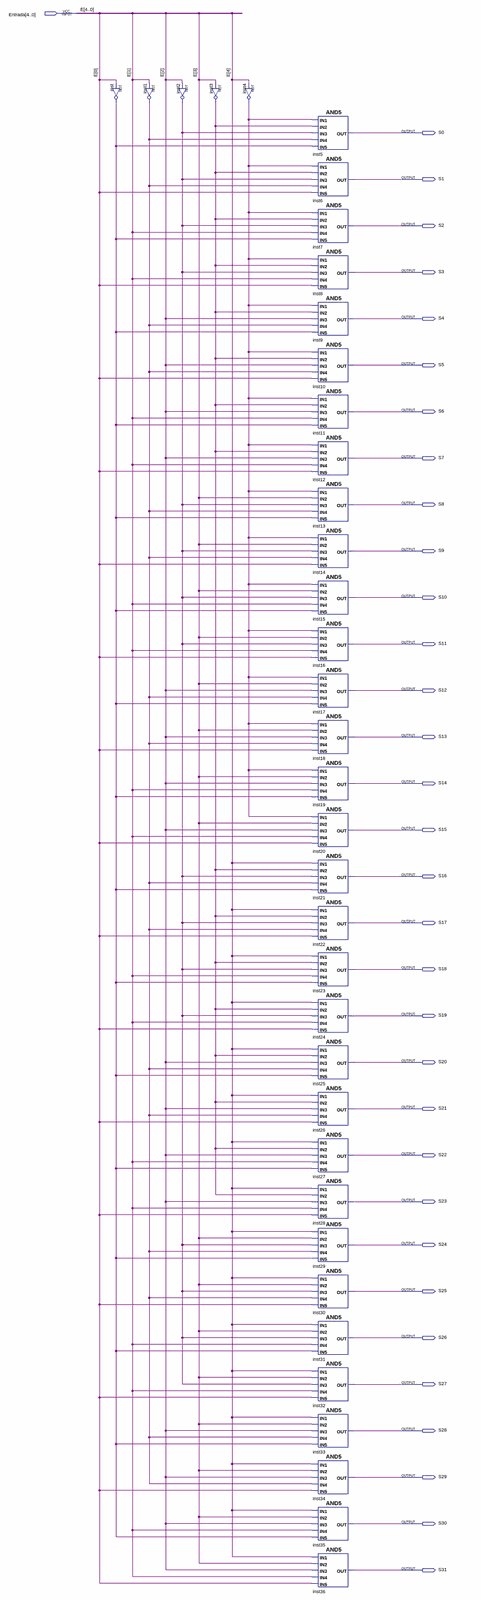
[diagram p0: schematic sheet, whole]
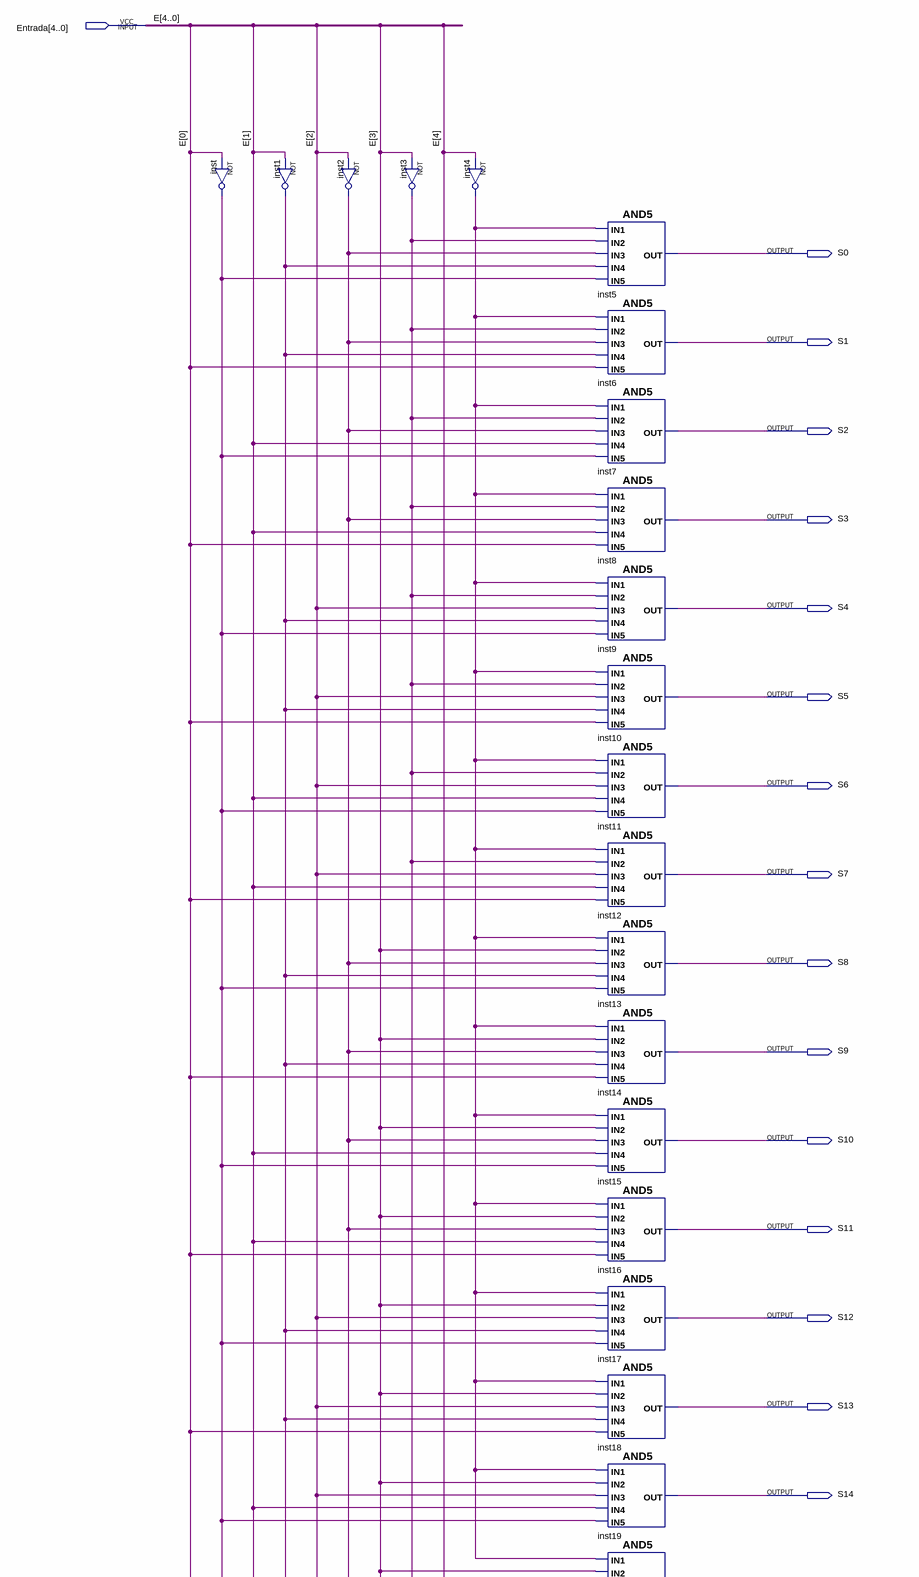
[diagram p1: schematic sheet, upper part]
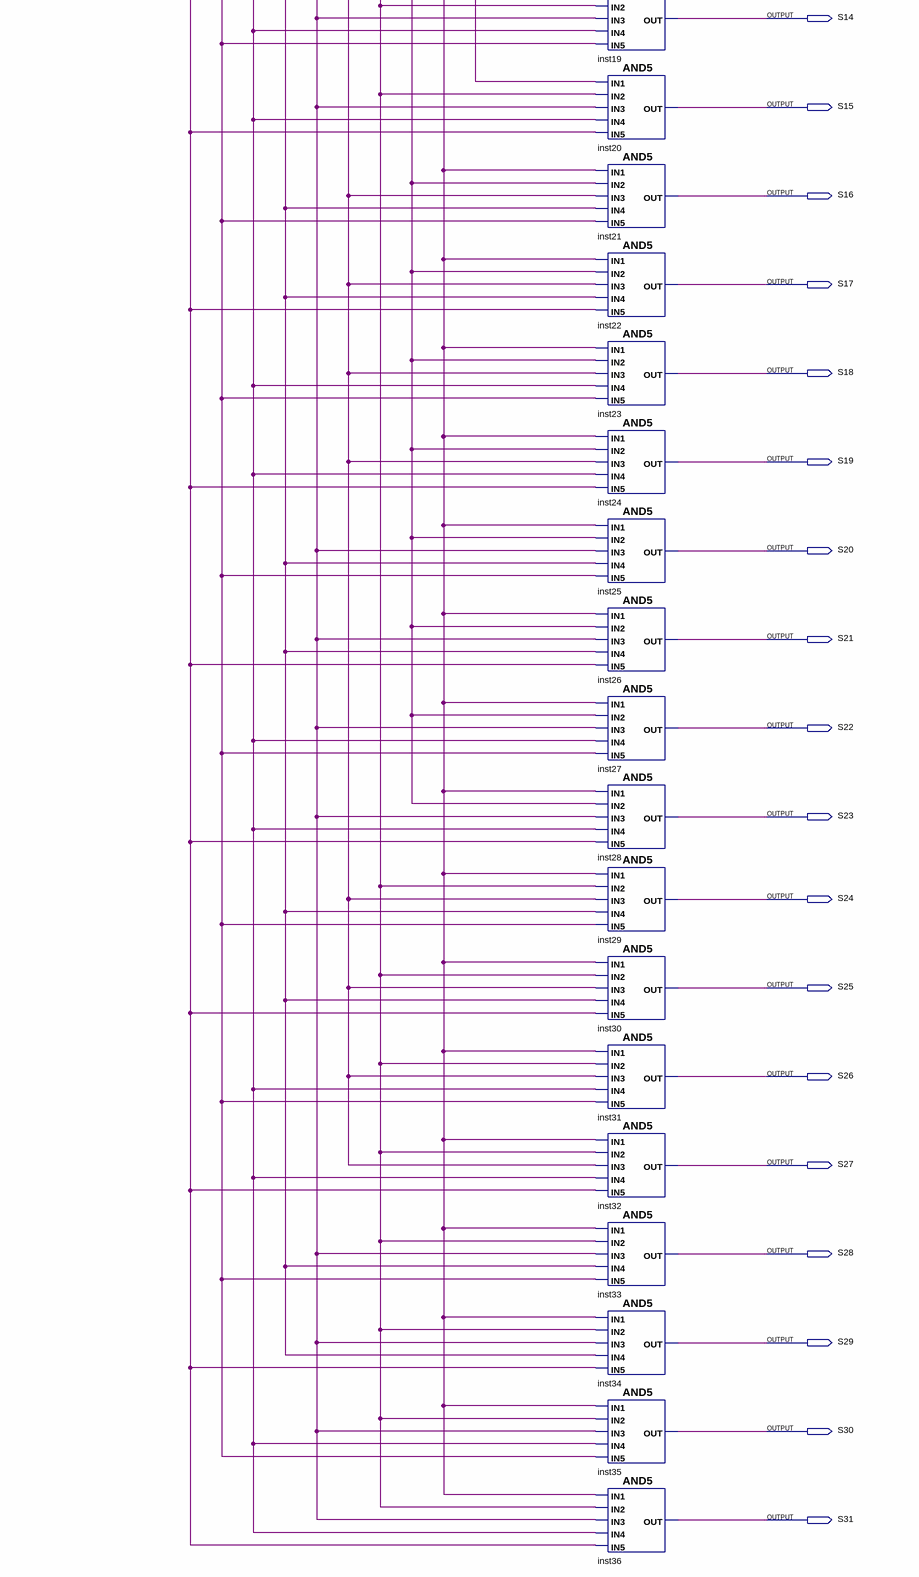
[diagram p2: schematic sheet, lower part]
// Quartus schematic Demu5x32.bdf as structural Verilog: 37 symbols, 33 pins
module Demu5x32 (
  input  [4:0] Entrada,
  output S0,
  output S1,
  output S2,
  output S3,
  output S4,
  output S5,
  output S6,
  output S7,
  output S8,
  output S9,
  output S10,
  output S11,
  output S12,
  output S13,
  output S14,
  output S15,
  output S16,
  output S17,
  output S18,
  output S19,
  output S20,
  output S21,
  output S22,
  output S23,
  output S24,
  output S25,
  output S26,
  output S27,
  output S28,
  output S29,
  output S30,
  output S31
);

  wire inst1_out, inst2_out, inst3_out, inst4_out, inst_out;

  not inst (inst_out, Entrada[0]);
  not inst1 (inst1_out, Entrada[1]);
  not inst2 (inst2_out, Entrada[2]);
  not inst3 (inst3_out, Entrada[3]);
  not inst4 (inst4_out, Entrada[4]);
  and inst5 (S0, inst4_out, inst3_out, inst2_out, inst1_out, inst_out);
  and inst6 (S1, inst4_out, inst3_out, inst2_out, inst1_out, Entrada[0]);
  and inst7 (S2, inst4_out, inst3_out, inst2_out, Entrada[1], inst_out);
  and inst8 (S3, inst4_out, inst3_out, inst2_out, Entrada[1], Entrada[0]);
  and inst9 (S4, inst4_out, inst3_out, Entrada[2], inst1_out, inst_out);
  and inst10 (S5, inst4_out, inst3_out, Entrada[2], inst1_out, Entrada[0]);
  and inst11 (S6, inst4_out, inst3_out, Entrada[2], Entrada[1], inst_out);
  and inst12 (S7, inst4_out, inst3_out, Entrada[2], Entrada[1], Entrada[0]);
  and inst13 (S8, inst4_out, Entrada[3], inst2_out, inst1_out, inst_out);
  and inst14 (S9, inst4_out, Entrada[3], inst2_out, inst1_out, Entrada[0]);
  and inst15 (S10, inst4_out, Entrada[3], inst2_out, Entrada[1], inst_out);
  and inst16 (S11, inst4_out, Entrada[3], inst2_out, Entrada[1], Entrada[0]);
  and inst17 (S12, inst4_out, Entrada[3], Entrada[2], inst1_out, inst_out);
  and inst18 (S13, inst4_out, Entrada[3], Entrada[2], inst1_out, Entrada[0]);
  and inst19 (S14, inst4_out, Entrada[3], Entrada[2], Entrada[1], inst_out);
  and inst20 (S15, inst4_out, Entrada[3], Entrada[2], Entrada[1], Entrada[0]);
  and inst21 (S16, Entrada[4], inst3_out, inst2_out, inst1_out, inst_out);
  and inst22 (S17, Entrada[4], inst3_out, inst2_out, inst1_out, Entrada[0]);
  and inst23 (S18, Entrada[4], inst3_out, inst2_out, Entrada[1], inst_out);
  and inst24 (S19, Entrada[4], inst3_out, inst2_out, Entrada[1], Entrada[0]);
  and inst25 (S20, Entrada[4], inst3_out, Entrada[2], inst1_out, inst_out);
  and inst26 (S21, Entrada[4], inst3_out, Entrada[2], inst1_out, Entrada[0]);
  and inst27 (S22, Entrada[4], inst3_out, Entrada[2], Entrada[1], inst_out);
  and inst28 (S23, Entrada[4], inst3_out, Entrada[2], Entrada[1], Entrada[0]);
  and inst29 (S24, Entrada[4], Entrada[3], inst2_out, inst1_out, inst_out);
  and inst30 (S25, Entrada[4], Entrada[3], inst2_out, inst1_out, Entrada[0]);
  and inst31 (S26, Entrada[4], Entrada[3], inst2_out, Entrada[1], inst_out);
  and inst32 (S27, Entrada[4], Entrada[3], inst2_out, Entrada[1], Entrada[0]);
  and inst33 (S28, Entrada[4], Entrada[3], Entrada[2], inst1_out, inst_out);
  and inst34 (S29, Entrada[4], Entrada[3], Entrada[2], inst1_out, Entrada[0]);
  and inst35 (S30, Entrada[4], Entrada[3], Entrada[2], Entrada[1], inst_out);
  and inst36 (S31, Entrada[4], Entrada[3], Entrada[2], Entrada[1], Entrada[0]);

  // Other names for the same wires on the sheet: E[4:0] = Entrada
endmodule
